# Altium schematic sheet Sheet1_MCU.SchDoc: JJGEEX_Homie_POC1
size Legal; Author: Jonas Cooper; CompanyName: JJ-GEEX; DrawnBy: Jonas Cooper; Organization: Homie Secure Smarthome; Address1: -; Address2: CU Boulder ECEE; Address3: -; Address4: Capstone; DocumentNumber: 1; Revision: 1; SheetNumber: 1; SheetTotal: 4
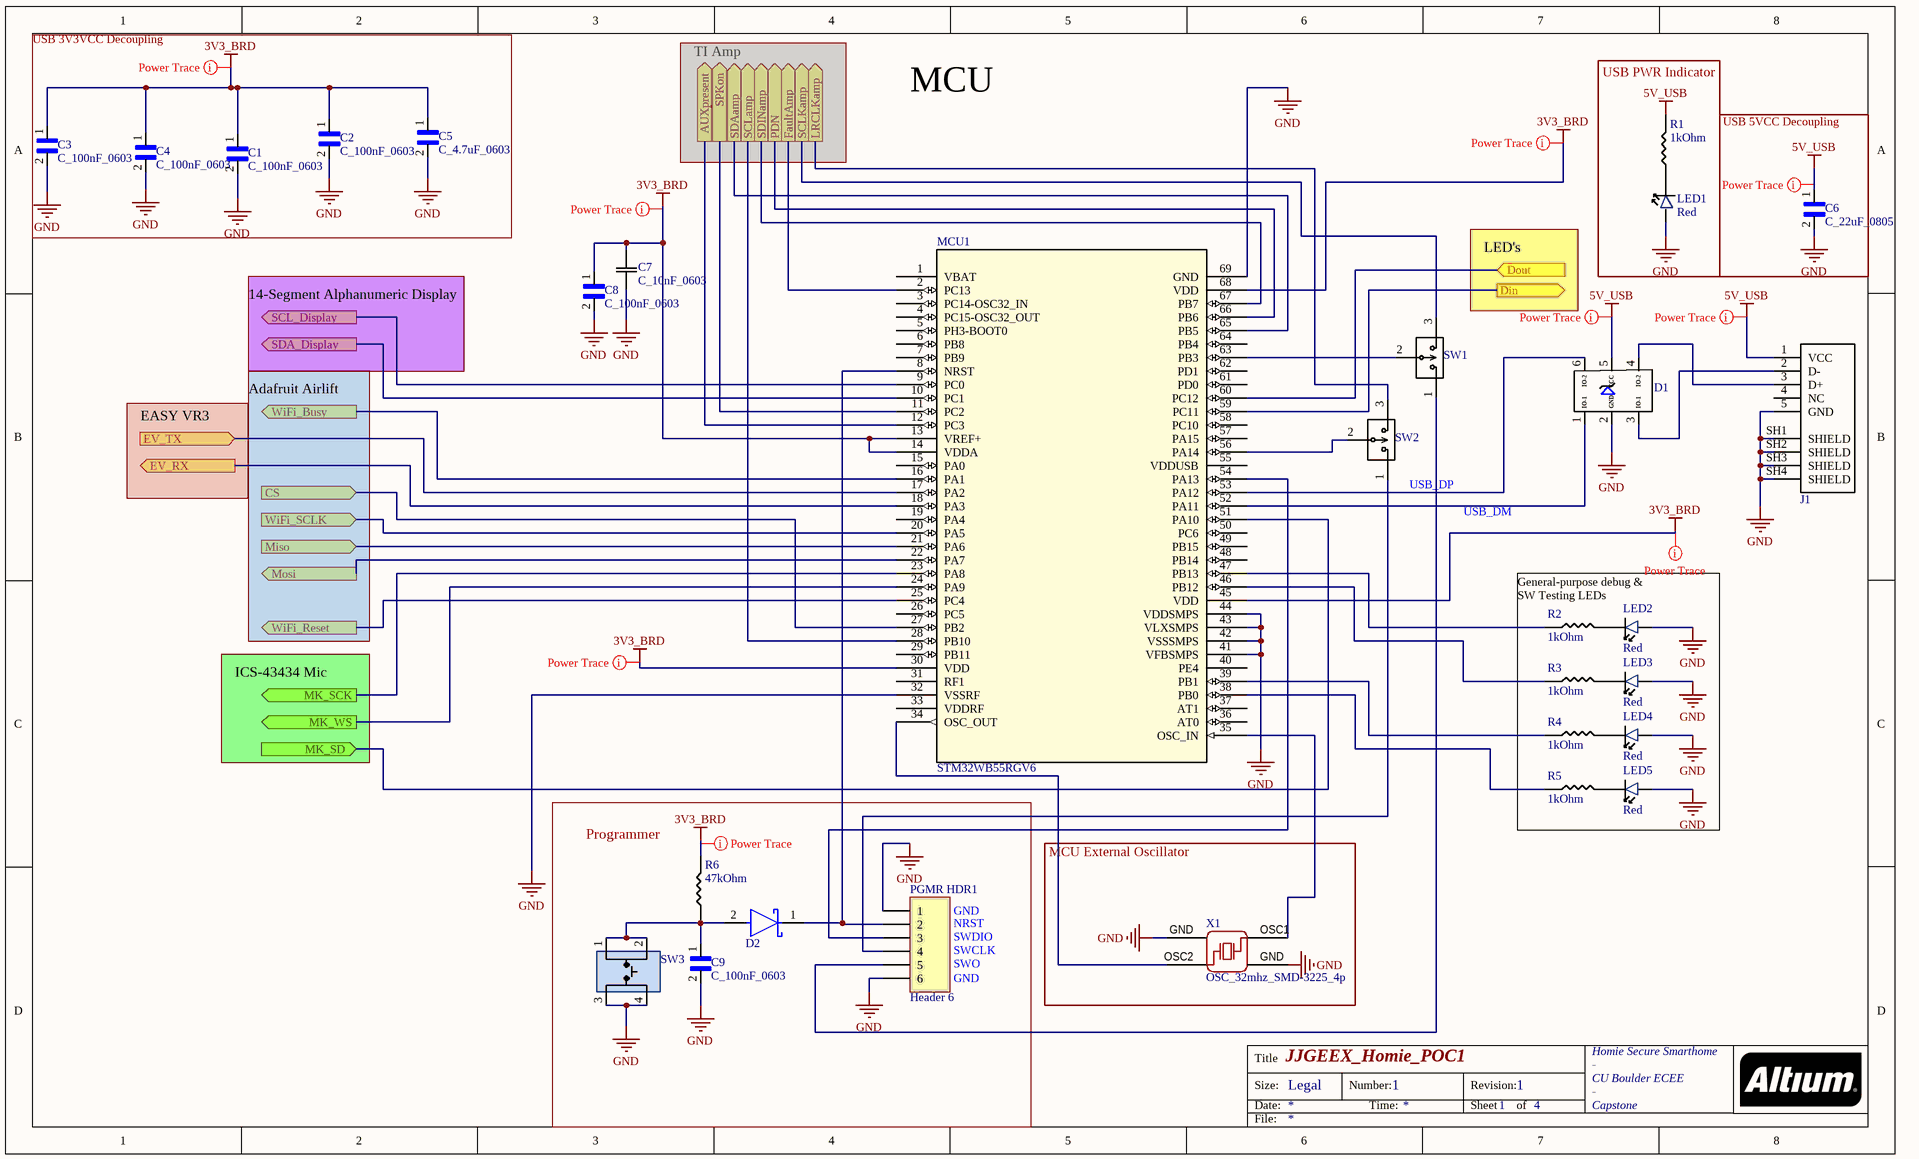
[diagram p0: Sheet1_MCU.SchDoc]

## Parts
C1  C_100nF_0603  [CAPC1608X90]
C2  C_100nF_0603  [CAPC1608X90]
C3  C_100nF_0603  [CAPC1608X90]
C4  C_100nF_0603  [CAPC1608X90]
C5  C_4.7uF_0603  [CAPC1608X90N]
C6  C_22uF_0805  [CAPC2012X140N]
C7  C_10nF_0603  [CAP_0603_S_WAL]
C8  C_100nF_0603  [CAPC1608X90]
C9  C_100nF_0603  [CAPC1608X90]
D1  IP4234CZ6,125  [TVS]  (value not drawn)
D2  BAT54KFILM  [STMicroelectronics_SOD-523_MFG]  (value not drawn)
J1  XM7D-0512  [USB_2]  (value not drawn)
LED1  value Red  [LED0603-R-RD]  (hidden comment: KT-0603R)
LED2  value Red  [LED0603-R-RD]  (hidden comment: KT-0603R)
LED3  value Red  [LED0603-R-RD]  (hidden comment: KT-0603R)
LED4  value Red  [LED0603-R-RD]  (hidden comment: KT-0603R)
LED5  value Red  [LED0603-R-RD]  (hidden comment: KT-0603R)
MCU1  STM32WB55RGV6  [VFQFPN68_8X8_STM]
PGMR_HDR1  Header 6  [HDR1X6]
R1  value 1kOhm  [R0603]  (hidden comment: 1 kOhm)
R2  value 1kOhm  [R0603]  (hidden comment: 1 kOhm)
R3  value 1kOhm  [R0603]  (hidden comment: 1 kOhm)
R4  value 1kOhm  [R0603]  (hidden comment: 1 kOhm)
R5  value 1kOhm  [R0603]  (hidden comment: 1 kOhm)
R6  value 47kOhm  [R0603]  (hidden comment: 47 kOhm)
SW1  PREC003SAAN-RC  [3_PIN_100mil]  (value not drawn)
SW2  PREC003SAAN-RC  [3_PIN_100mil]  (value not drawn)
SW3  TL3305AF160QG  [Switch_JLC]  (value not drawn)
X1  OSC_32mhz_SMD-3225_4p  [OSC-SMD_4P-L3.2-W2.5-BL]

## Blocks framed on the sheet
USB 3V3VCC Decoupling: C1-C5
USB PWR Indicator: LED1 R1
USB 5VCC Decoupling: C6
Programmer: C9 D2 PGMR_HDR1 R6 SW3
MCU External Oscillator: X1

## Ports
AUXpresent (out), CS (in), Din (out), Dout (in), EV_RX (out), EV_TX (in), FaultAmp (out), LRCLKamp (out), Miso (in), MK_SCK (out), MK_SD (in), MK_WS (out), Mosi (out), PDN (out), SCL_Display (out), SCLamp (out), SCLKamp (out), SDA_Display (out), SDAamp (out), SDINamp (out), SPKon (out), WiFi_Busy (out), WiFi_Reset (out), WiFi_SCLK (in)

## Nets
3V3_BRD: C1.1 C2.1 C3.1 C4.1 C5.1 C7.2 C8.1 MCU1.13(VREF+) MCU1.14(VDDA) MCU1.30(VDD) MCU1.45(VDD) MCU1.68(VDD) R6.2
5V_USB: C6.1 D1.5(VCC) J1.1(VCC) R1.2
GND: C1.2 C2.2 C3.2 C4.2 C5.2 C6.2 C7.1 C8.2 C9.2 D1.2(GND) J1.5(GND) J1.SH1(SHIELD) J1.SH2(SHIELD) J1.SH3(SHIELD) J1.SH4(SHIELD) LED1.2 LED2.2 LED3.2 LED4.2 LED5.2 MCU1.32(VSSRF) MCU1.41(VFBSMPS) MCU1.42(VSSSMPS) MCU1.43(VLXSMPS) MCU1.44(VDDSMPS) MCU1.69(GND) PGMR_HDR1.1 PGMR_HDR1.6 SW3.3 SW3.4 X1.GND
AUXpresent: MCU1.12(PC3) ; port AUXpresent
CS: MCU1.27(PB2) ; port CS
Din: MCU1.59(PC11) ; port Din
Dout: MCU1.60(PC12) ; port Dout
EV_RX: MCU1.18(PA3) ; port EV_RX
EV_TX: MCU1.17(PA2) ; port EV_TX
FaultAmp: MCU1.2(PC13) ; port FaultAmp
LRCLKamp: SW2.3 ; port LRCLKamp
Miso: MCU1.21(PA6) ; port Miso
MK_SCK: MCU1.23(PA8) ; port MK_SCK
MK_SD: MCU1.51(PA10) ; port MK_SD
MK_WS: MCU1.24(PA9) ; port MK_WS
Mosi: MCU1.22(PA7) ; port Mosi
PDN: MCU1.66(PB6) ; port PDN
SCL_Display: MCU1.9(PC0) ; port SCL_Display
SCLamp: MCU1.28(PB10) ; port SCLamp
SCLKamp: SW1.3 ; port SCLKamp
SDA_Display: MCU1.10(PC1) ; port SDA_Display
SDAamp: MCU1.65(PB5) ; port SDAamp
SDINamp: MCU1.67(PB7) ; port SDINamp
SPKon: MCU1.11(PC2) ; port SPKon
WiFi_Busy: MCU1.16(PA1) ; port WiFi_Busy
WiFi_Reset: MCU1.25(PC4) ; port WiFi_Reset
WiFi_SCLK: MCU1.20(PA5) ; port WiFi_SCLK
NetC9_1: C9.1 D2.2(A) R6.1 SW3.1 SW3.2
NetD1_1: D1.1(IO-1) MCU1.52(PA11)
NetD1_3: D1.3(IO-1) J1.2(D-)
NetD1_4: D1.4(IO-2) J1.3(D+)
NetD1_6: D1.6(IO-2) MCU1.53(PA12)
NetD2_1: D2.1(C) MCU1.8(NRST) PGMR_HDR1.2
NetLED1_1: LED1.1 R1.1
NetLED2_1: LED2.1 R2.2
NetLED3_1: LED3.1 R3.2
NetLED4_1: LED4.1 R4.2
NetLED5_1: LED5.1 R5.2
NetMCU1_34: MCU1.34(OSC_OUT) X1.OSC2
NetMCU1_35: MCU1.35(OSC_IN) X1.OSC1
NetMCU1_38: MCU1.38(PB0) R5.1
NetMCU1_39: MCU1.39(PB1) R4.1
NetMCU1_46: MCU1.46(PB12) R3.1
NetMCU1_47: MCU1.47(PB13) R2.1
NetMCU1_54: MCU1.54(PA13) PGMR_HDR1.3
NetMCU1_56: MCU1.56(PA14) SW2.2
NetMCU1_63: MCU1.63(PB3) SW1.2
NetPGMR_HDR1_4: PGMR_HDR1.4 SW2.1
NetPGMR_HDR1_5: PGMR_HDR1.5 SW1.1

Not connected (* = marked no-connect by the designer): J1 4(NC); MCU1 1(VBAT) 3(PC14-OSC32_IN) 4(PC15-OSC32_OUT) 5(PH3-BOOT0) 6(PB8) 7(PB9) 15(PA0) 19(PA4) 26(PC5) 29(PB11) 31(RF1) 33(VDDRF) 36(AT0) 37(AT1) 40(PE4) 48(PB14) 49(PB15) 50(PC6) 55(VDDUSB) 57(PA15) 58(PC10) 61(PD0) 62(PD1) 64(PB4)

## Layout directives
rule Width Constraint [Pref Width = 13mil    Min Width = 6mil    Max Width = 100mil]: 3V3_BRD, 5V_USB

## Notes on the sheet
- TI Amp
- MCU
- 14-Segment Alphanumeric Display
- LED's
- EASY VR3
- Adafruit Airlift
- (near SW2) USB_DP
- USB_DM
- ICS-43434 Mic
- General-purpose debug &
  SW Testing LEDs
- (near PGMR_HDR1) GND
- (near PGMR_HDR1) NRST
- (near PGMR_HDR1) SWDIO
- (near PGMR_HDR1) SWCLK
- (near PGMR_HDR1) SWO
- Title
- Size:
- Date:
- Legal
- Number:
- Time:
- Revision:
- Sheet
- of
- File:

## Library data of the parts
C1-C4 C8 C9 = C_100nF_0603: 0.1µF/100nF  Â±10% 50V Ceramic Capacitor X7R 0603 _1608 Metric_; MP: CC0603KRX7R9BB104; MF: Yageo; Digi-Key_Purchase_URL: https://www.digikey.com/product-detail/en/yageo/CC0603KRX7R9BB104/311-1344-1-ND/2103128?utm_source=snapeda&utm_medium=aggregator&utm_campaign=symbol; Digi-Key_Part_Number: 311-1344-1-ND; Package: 0603 Yageo; LCSC#: C14663; SnapEDA Link: https://www.snapeda.com/parts/CC0603KRX7R9BB104/Yageo/view-part/78680/?ref=snap
C5 = C_4.7uF_0603: 4.7µF ±10% 16V Ceramic Capacitor X5R 0603 (1608 Metric); MF: Samsung Electro-Mechanics; MP: CL10A475KO8NNNC; Price: None; Availability: Unavailable; Package: 0603 Samsung; SnapEDA_Link: https://www.snapeda.com/parts/CL10A475KO8NNNC/Samsung%20Electro-Mechanics/view-part/3598183/?ref=snap; LCSC#: C19666; Arrow_Electronics-Purchase-URL: https://snapeda.com/shop?store=Arrow+Electronics&id=3598183
C6 = C_22uF_0805: 22µF 0805 ±20% 25V Ceramic Capacitor X5R 0805 (2012 Metric); MF: Samsung; MP: CL21A226MAQNNNE; SnapEDA_Link: https://www.snapeda.com/parts/CL21A226MAQNNNE/Samsung%20Electro-Mechanics/view-part/620487/?ref=snap; Check_prices: https://www.snapeda.com/parts/CL21A226MAQNNNE/Samsung%20Electro-Mechanics/view-part/620487/?ref=eda; Digi-Key_Part_Number: 1276-2908-1-ND; Value: *; Package: 0805 Samsung; Purchase-URL: https://pricing.snapeda.com/search/part/CL21A226MAQNNNE/?ref=eda; LCSC#: C45783
C7 = C_10nF_0603: 10nf 0603 cap; Manufacturer_Part_Number: 0603B103J100CT; Vendor: Walsin; Built_By: EMA_UL_Team; SourceLibrary: Walsin_2016-07-18_2; Type: DEV; Copyright: Copyright (C) 2018 Accelerated Designs. All rights reserved; RefDes: RefDes; LCSC#: C57112
D1 = D_TVS_Diode: Clamp Ipp Tvs Diode Surface Mount 6-TSOP; Value: TVS DIODE 5.5V 6TSOP; Type: Extended; Digikey Part: 1727-4717-1-ND; Digikey Link: https://www.digikey.com/product-detail/en/IP4234CZ6%2c125/1727-4717-1-ND/2531156/?itemSeq=304982369; MFR Part #: IP4234CZ6,125; LCSC Part#: C455086
D2 = BAT54KFILM: BAT54 Diode; Manufacturer: STMicroelectronics; MFR#: BAT54KFILM; LCSC#: C283259; Parameter 2: *; Parameter 3: *
J1 = J_USB_2_B_Mini: USB - mini B USB 2.0 Receptacle Connector 5 Position Through Hole, Right Angle; Value: CONN RCPT USB2.0 MINI B 5P R/A; Digikey Link: https://www.digikey.com/product-detail/en/XM7D-0512/OR1205-ND/4695531/?itemSeq=304982356; Digikey Part: OR1205-ND
LED1-LED5 = LED_RED_0603: LIGHT EMITTING DIODES (LED) RED 520~625NM 90~100MCD@20MA TOP VIEW 0603 ROHS; MFR: Hubei KENTO Elec; MFR#: KT-0603R; LCSC#: C2286
MCU1 = STM32WB55RGV6: STM32 Microcontroller; Vendor: STMicroelectronics; Built_By: EMA_Cory; SourceLibrary: STMicroelectronics_2020-09-16; Datasheet: https://www.st.com/resource/en/datasheet/stm32wb55rg.pdf; Manufacturer_Part_Number: STM32WB55RGV6; Copyright: Copyright (C) 2018 Accelerated Designs. All rights reserved; RefDes: RefDes; Type: DEV
PGMR_HDR1 = Header 6: Header, 6-Pin; LatestRevisionDate: 17-Jul-2002; LatestRevisionNote: Re-released for DXP Platform.; Publisher: Altium Limited
R1-R5 = R_1kOhm_0603: 1kOhm +-1%  0603; MFR: Uniroyal; Mfr#: 0603WAF1001T5E; LCSC#: 21190
R6 = R_47kOhm_0603: 47kOhm +-1%; MFR: Uniroyal; Mfr#: 0603WAF4702T5E; LCSC#: C25819
SW1 SW2 = SW_3Pin_100mil_Switch: Connector Header Through Hole 3 position 0.100" (2.54mm); Value: CONN HEADER VERT 3POS 2.54MM; Digikey Link: https://www.digikey.com/product-detail/en/PREC003SAAN-RC/S1012EC-03-ND/2774851/?itemSeq=304982371; Digikey Part: S1012EC-03-ND
SW3 = SW_Push_Button_JLC: Tactile Switch SPST-NO Top Actuated Surface Mount; MFR Part #: UK-B0228-G5-160-JZ; Value: SWITCH TACTILE SPST-NO 50MA 12V; Digikey Link: https://www.digikey.com/product-detail/en/TL3305AF160QG/EG5350CT-ND/5816195/?itemSeq=304982361; Digikey Part: EG5350CT-ND; LCSC Part#: C620316; Type: Basic
X1 = OSC_32mhz_SMD-3225_4p: SMD CRYSTAL RESONATORS 32MHZ ±10PPM SMD-3225_4P ROHS; MFR: Seiko Epson; MFR#: X1E000021016300; LCSC#: C91742; PKG: SMD-3225_4P; Datasheet: https://datasheet.lcsc.com/szlcsc/Seiko-Epson-X1E0000210163000G_C91742.pdf